# Altium schematic sheet Buck_TPSM82913_5V0.SchDoc
size B; SheetNumber: 9; SheetTotal: 15
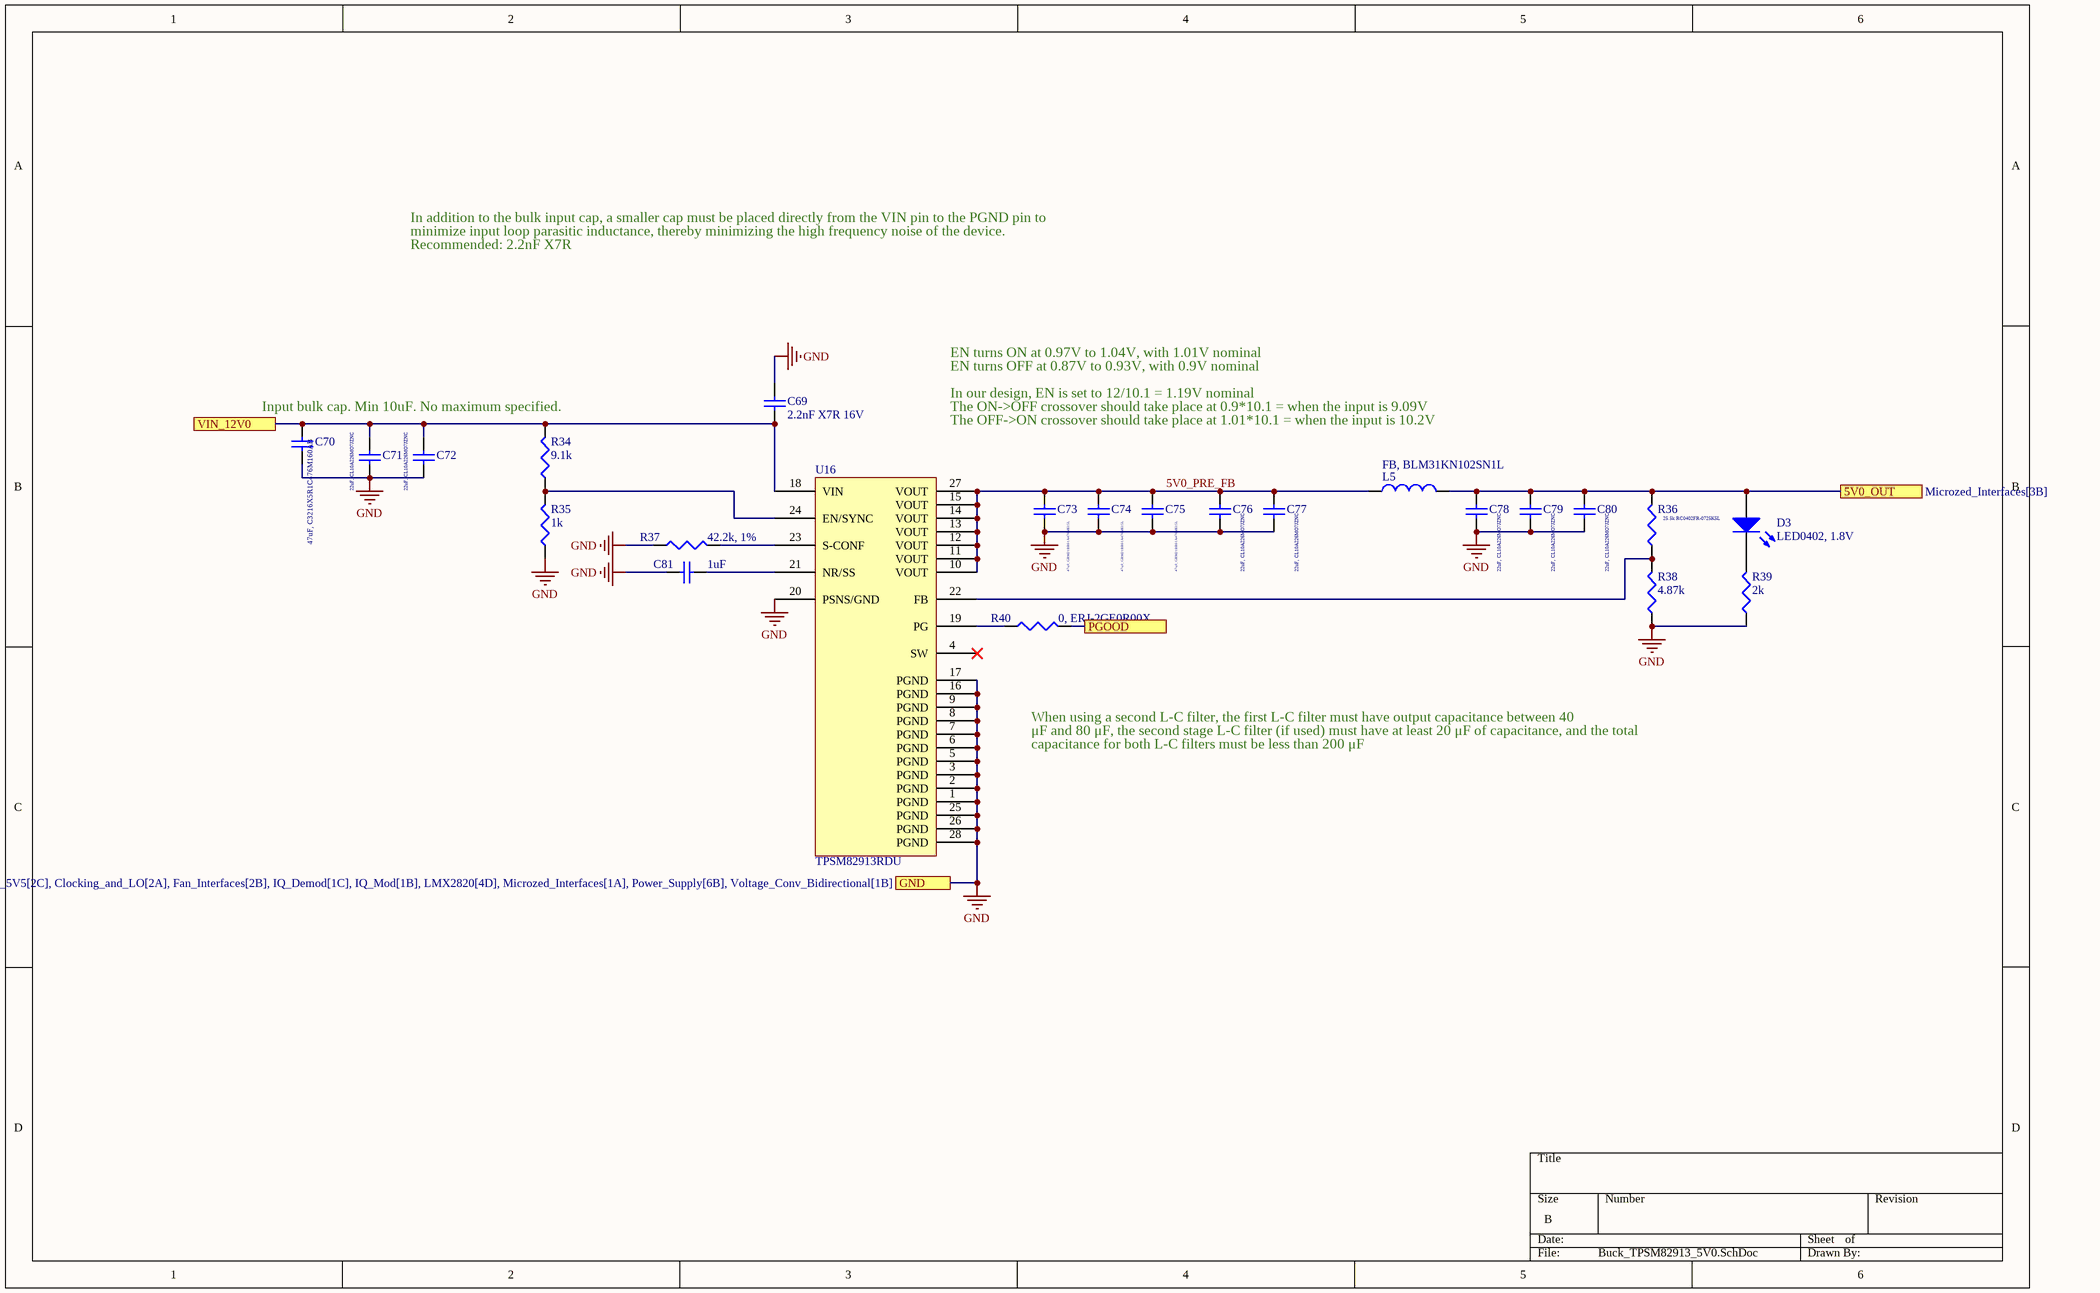
[diagram p0: Buck_TPSM82913_5V0.SchDoc]

## Parts
C69  2.2nF X7R 16V  [SMD-0402]
C70  47uF, C3216X5R1C476M160AB  [SMD-1206]
C71  22uF, CL10A226MO7JZNC  [SMD-0603]
C72  22uF, CL10A226MO7JZNC  [SMD-0603]
C73  47uF, GRM21BR61A476ME15L  [SMD-0805]
C74  47uF, GRM21BR61A476ME15L  [SMD-0805]
C75  47uF, GRM21BR61A476ME15L  [SMD-0805]
C76  22uF, CL10A226MO7JZNC  [SMD-0603]
C77  22uF, CL10A226MO7JZNC  [SMD-0603]
C78  22uF, CL10A226MO7JZNC  [SMD-0603]
C79  22uF, CL10A226MO7JZNC  [SMD-0603]
C80  22uF, CL10A226MO7JZNC  [SMD-0603]
C81  1uF  [SMD-0402]
D3  LED0402, 1.8V  [LED-0402]
L5  FB, BLM31KN102SN1L  [SMD-1206]
R34  9.1k  [SMD-0402]
R35  1k  [SMD-0402]
R36  25.5k RC0402FR-0725K5L  [SMD-0402]
R37  42.2k, 1%  [SMD-0402]
R38  4.87k  [SMD-0402]
R39  2k  [SMD-0402]
R40  0, ERJ-2GE0R00X  [SMD-0402]
U16  TPSM82913RDU  [TPSM82913DRUR]

## Ports
5V0_OUT (see Microzed_Interfaces[3B]), GND (see Microzed_Interfaces[3B], 3V7_to_3V3_LDO[1B], 5V5_to_5V0_LDO[1C], Buck_TPSM82913_1V8[3C], Buck_TPSM82913_3V7[3C], Buck_TPSM82913_5V5[2C], Clocking_and_LO[2A], Fan_Interfaces[2B], IQ_Demod[1C], IQ_Mod[1B], LMX2820[4D], Microzed_Interfaces[1A], Power_Supply[6B], Voltage_Conv_Bidirectional[1B]), PGOOD (see Microzed_Interfaces[3B]), VIN_12V0 (see Microzed_Interfaces[3B], Buck_TPSM82913_3V7[1B], Buck_TPSM82913_5V5[1B])

## Nets
GND: C69.2 C70.1 C71.1 C72.1 C73.1 C74.1 C75.1 C76.1 C77.1 C78.1 C79.1 C80.1 C81.1 R35.1 R37.1 R38.1 R39.1 U16.1(PGND) U16.2(PGND) U16.3(PGND) U16.5(PGND) U16.6(PGND) U16.7(PGND) U16.8(PGND) U16.9(PGND) U16.16(PGND) U16.17(PGND) U16.20(PSNS/GND) U16.25(PGND) U16.26(PGND) U16.28(PGND) ; port GND
5V0_OUT: C78.2 C79.2 C80.2 D3.1(A) L5.2 R36.2 ; port 5V0_OUT
5V0_PRE_FB: C73.2 C74.2 C75.2 C76.2 C77.2 L5.1 U16.10(VOUT) U16.11(VOUT) U16.12(VOUT) U16.13(VOUT) U16.14(VOUT) U16.15(VOUT) U16.27(VOUT)
PGOOD: R40.2 ; port PGOOD
VIN_12V0: C69.1 C70.2 C71.2 C72.2 R34.2 U16.18(VIN) ; port VIN_12V0
NetC81_2: C81.2 U16.21(NR/SS)
NetD3_2: D3.2(K) R39.2
NetR34_1: R34.1 R35.2 U16.24(EN/SYNC)
NetR36_1: R36.1 R38.2 U16.22(FB)
NetR37_2: R37.2 U16.23(S-CONF)
NetR40_1: R40.1 U16.19(PG)

Not connected (* = marked no-connect by the designer): U16 4(SW)*

## Notes on the sheet
- In addition to the bulk input cap, a smaller cap must be placed directly from the VIN pin to the PGND pin to
- minimize input loop parasitic inductance, thereby minimizing the high frequency noise of the device.
- Recommended: 2.2nF X7R
- EN turns OFF at 0.87V to 0.93V, with 0.9V nominal
- EN turns ON at 0.97V to 1.04V, with 1.01V nominal
- Input bulk cap. Min 10uF. No maximum specified.
- In our design, EN is set to 12/10.1 = 1.19V nominal
- The ON->OFF crossover should take place at 0.9*10.1 = when the input is 9.09V
- The OFF->ON crossover should take place at 1.01*10.1 = when the input is 10.2V
- When using a second L-C filter, the first L-C filter must have output capacitance between 40
- μF and 80 μF, the second stage L-C filter (if used) must have at least 20 μF of capacitance, and the total
- capacitance for both L-C filters must be less than 200 μF

## Library data of the parts
C69 C81 = CAP0402: Ceramic Capacitor 0402
C70 = CAP1206: Ceramic Capacitor 1206 Imperial
C71 C72 C76-C80 = CAP0603: Ceramic Capacitor 0603
C73-C75 = CAP0805: Ceramic Capacitor 0805 Imperial (2012 Metric)
D3 = LED0402: LED 0402
L5 = L1206: Inductor 1206
R34-R40 = RES0402: Resistor-0402